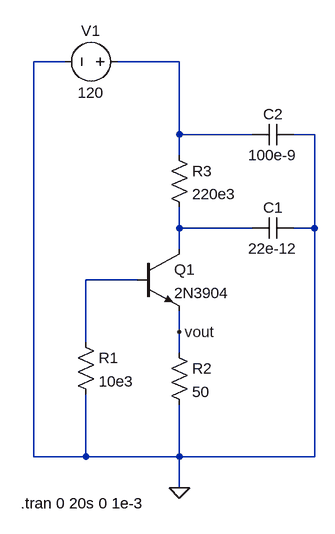
[diagram p0: schematic APG.asc]
APG.asc, the LTspice schematic file:
Version 4
SHEET 1 880 680
WIRE 192 -176 144 -176
WIRE 368 -176 272 -176
WIRE 368 -64 368 -176
WIRE 480 -64 368 -64
WIRE 576 -64 544 -64
WIRE 368 -32 368 -64
WIRE 368 80 368 48
WIRE 480 80 368 80
WIRE 576 80 576 -64
WIRE 576 80 544 80
WIRE 368 112 368 80
WIRE 304 160 224 160
WIRE 368 240 368 208
WIRE 224 256 224 160
WIRE 368 272 368 240
WIRE 144 432 144 -176
WIRE 224 432 224 336
WIRE 224 432 144 432
WIRE 368 432 368 352
WIRE 368 432 224 432
WIRE 576 432 576 80
WIRE 576 432 368 432
WIRE 368 480 368 432
FLAG 368 480 0
FLAG 368 240 vout
SYMBOL voltage 288 -176 R90
WINDOW 0 -32 56 VBottom 2
WINDOW 3 32 56 VTop 2
WINDOW 123 0 0 Left 0
WINDOW 39 0 0 Left 0
SYMATTR InstName V1
SYMATTR Value 120
SYMBOL npn 304 112 R0
SYMATTR InstName Q1
SYMATTR Value 2N3904
SYMBOL res 208 240 R0
SYMATTR InstName R1
SYMATTR Value 10e3
SYMBOL res 352 256 R0
SYMATTR InstName R2
SYMATTR Value 50
SYMBOL res 352 -48 R0
SYMATTR InstName R3
SYMATTR Value 220e3
SYMBOL cap 544 64 R90
WINDOW 0 0 32 VBottom 2
WINDOW 3 32 32 VTop 2
SYMATTR InstName C1
SYMATTR Value 22e-12
SYMBOL cap 544 -80 R90
WINDOW 0 0 32 VBottom 2
WINDOW 3 32 32 VTop 2
SYMATTR InstName C2
SYMATTR Value 100e-9
TEXT 124 504 Left 2 !.tran 0 20s 0 1e-3

The netlist it stands for:
* APG.asc
V1 N001 0 120
Q1 N002 N003 vout 0 2N3904
R1 N003 0 10e3
R2 vout 0 50
R3 N001 N002 220e3
C1 0 N002 22e-12
C2 0 N001 100e-9
.model NPN NPN
.model PNP PNP
.lib standard.bjt
.tran 0 20s 0 1e-3
.backanno
.end